# Altium schematic sheet led7.SchDoc
size A4
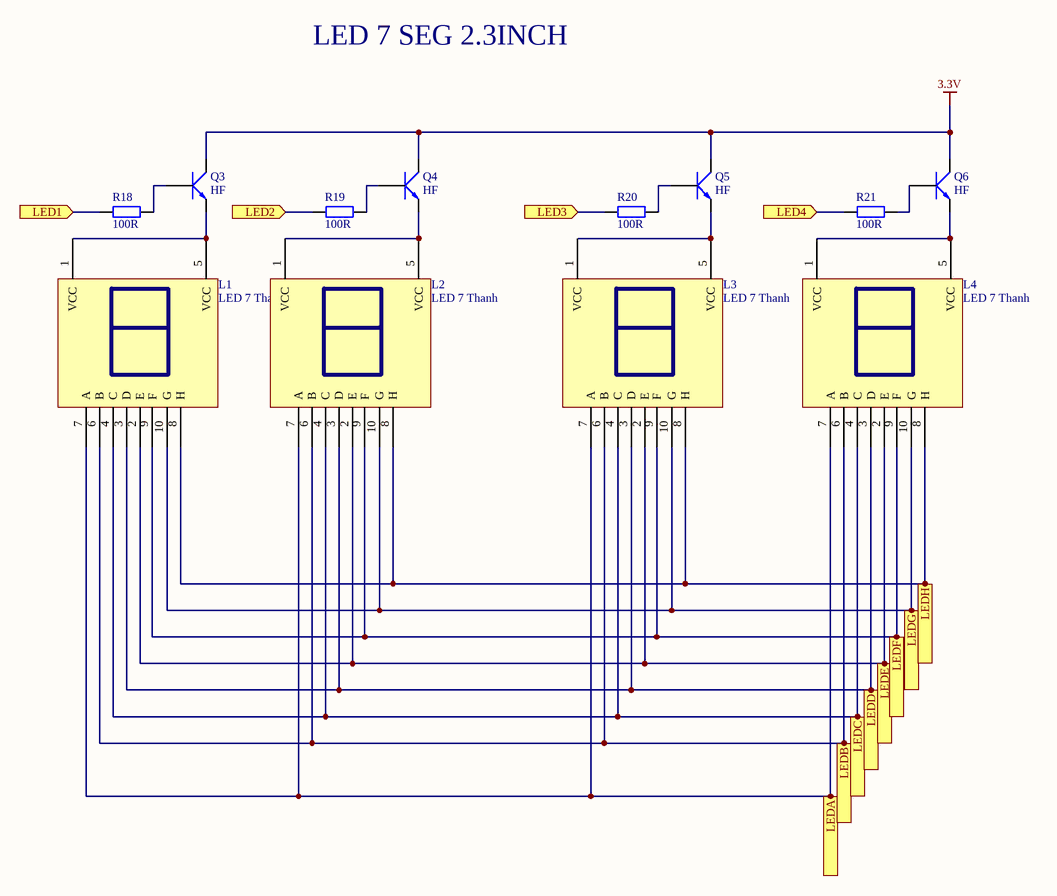
[diagram p0: led7.SchDoc]

## Parts
L1  LED 7 Thanh  [LED7SEG_2.3inch]
L2  LED 7 Thanh  [LED7SEG_2.3inch]
L3  LED 7 Thanh  [LED7SEG_2.3inch]
L4  LED 7 Thanh  [LED7SEG_2.3inch]
Q3  HF  [SOT23]
Q4  HF  [SOT23]
Q5  HF  [SOT23]
Q6  HF  [SOT23]
R18  100R  [tro smd 0805]
R19  100R  [tro smd 0805]
R20  100R  [tro smd 0805]
R21  100R  [tro smd 0805]

## Ports
LED1 (in), LED2 (in), LED3 (in), LED4 (in), LEDA (in), LEDB (in), LEDC (in), LEDD (in), LEDE (in), LEDF (in), LEDG (in), LEDH (in)

## Nets
3.3V: Q3.3(C) Q4.3(C) Q5.3(C) Q6.3(C)
LED1: R18.1 ; port LED1
LED2: R19.1 ; port LED2
LED3: R20.1 ; port LED3
LED4: R21.1 ; port LED4
LEDA: L1.7(A) L2.7(A) L3.7(A) L4.7(A) ; port LEDA
LEDB: L1.6(B) L2.6(B) L3.6(B) L4.6(B) ; port LEDB
LEDC: L1.4(C) L2.4(C) L3.4(C) L4.4(C) ; port LEDC
LEDD: L1.3(D) L2.3(D) L3.3(D) L4.3(D) ; port LEDD
LEDE: L1.2(E) L2.2(E) L3.2(E) L4.2(E) ; port LEDE
LEDF: L1.9(F) L2.9(F) L3.9(F) L4.9(F) ; port LEDF
LEDG: L1.10(G) L2.10(G) L3.10(G) L4.10(G) ; port LEDG
LEDH: L1.8(H) L2.8(H) L3.8(H) L4.8(H) ; port LEDH
NetL1_5: L1.5(VCC) Q3.2(E)
NetL2_5: L2.5(VCC) Q4.2(E)
NetL3_5: L3.5(VCC) Q5.2(E)
NetL4_1: L4.1(VCC) L4.5(VCC) Q6.2(E)
NetQ3_1: Q3.1(B) R18.2
NetQ4_1: Q4.1(B) R19.2
NetQ5_1: Q5.1(B) R20.2
NetQ6_1: Q6.1(B) R21.2

Not connected (* = marked no-connect by the designer): L1 1(VCC); L2 1(VCC); L3 1(VCC)

## Notes on the sheet
- LED 7 SEG 2.3INCH

## Library data of the parts
L1-L4 = LED 7x1 2.3inch Anot: Dán; Don_Vi: Con; Ma_Hang: MH000901; Ten_Linh_Kien: Led 7 2.3 1 Số Anot (Sáng Đỏ); Ghi_Chu: *; Kieu_Chan: *; Chung_Loai: Dán
Q3-Q6 = C1815 HF SMD: NPN transistor; Value: C9014
R18-R21 = Tro 0805 5% 100R: Dán; Don_Vi: Con; So_Chan: 2; Ten_Linh_Kien: Trở 0805 5% 100R; Ma_Hang: MH005251; Chung_Loai: Dán; Kieu_Chan: *